# EAGLE design top_spin (EAGLE 5.11)
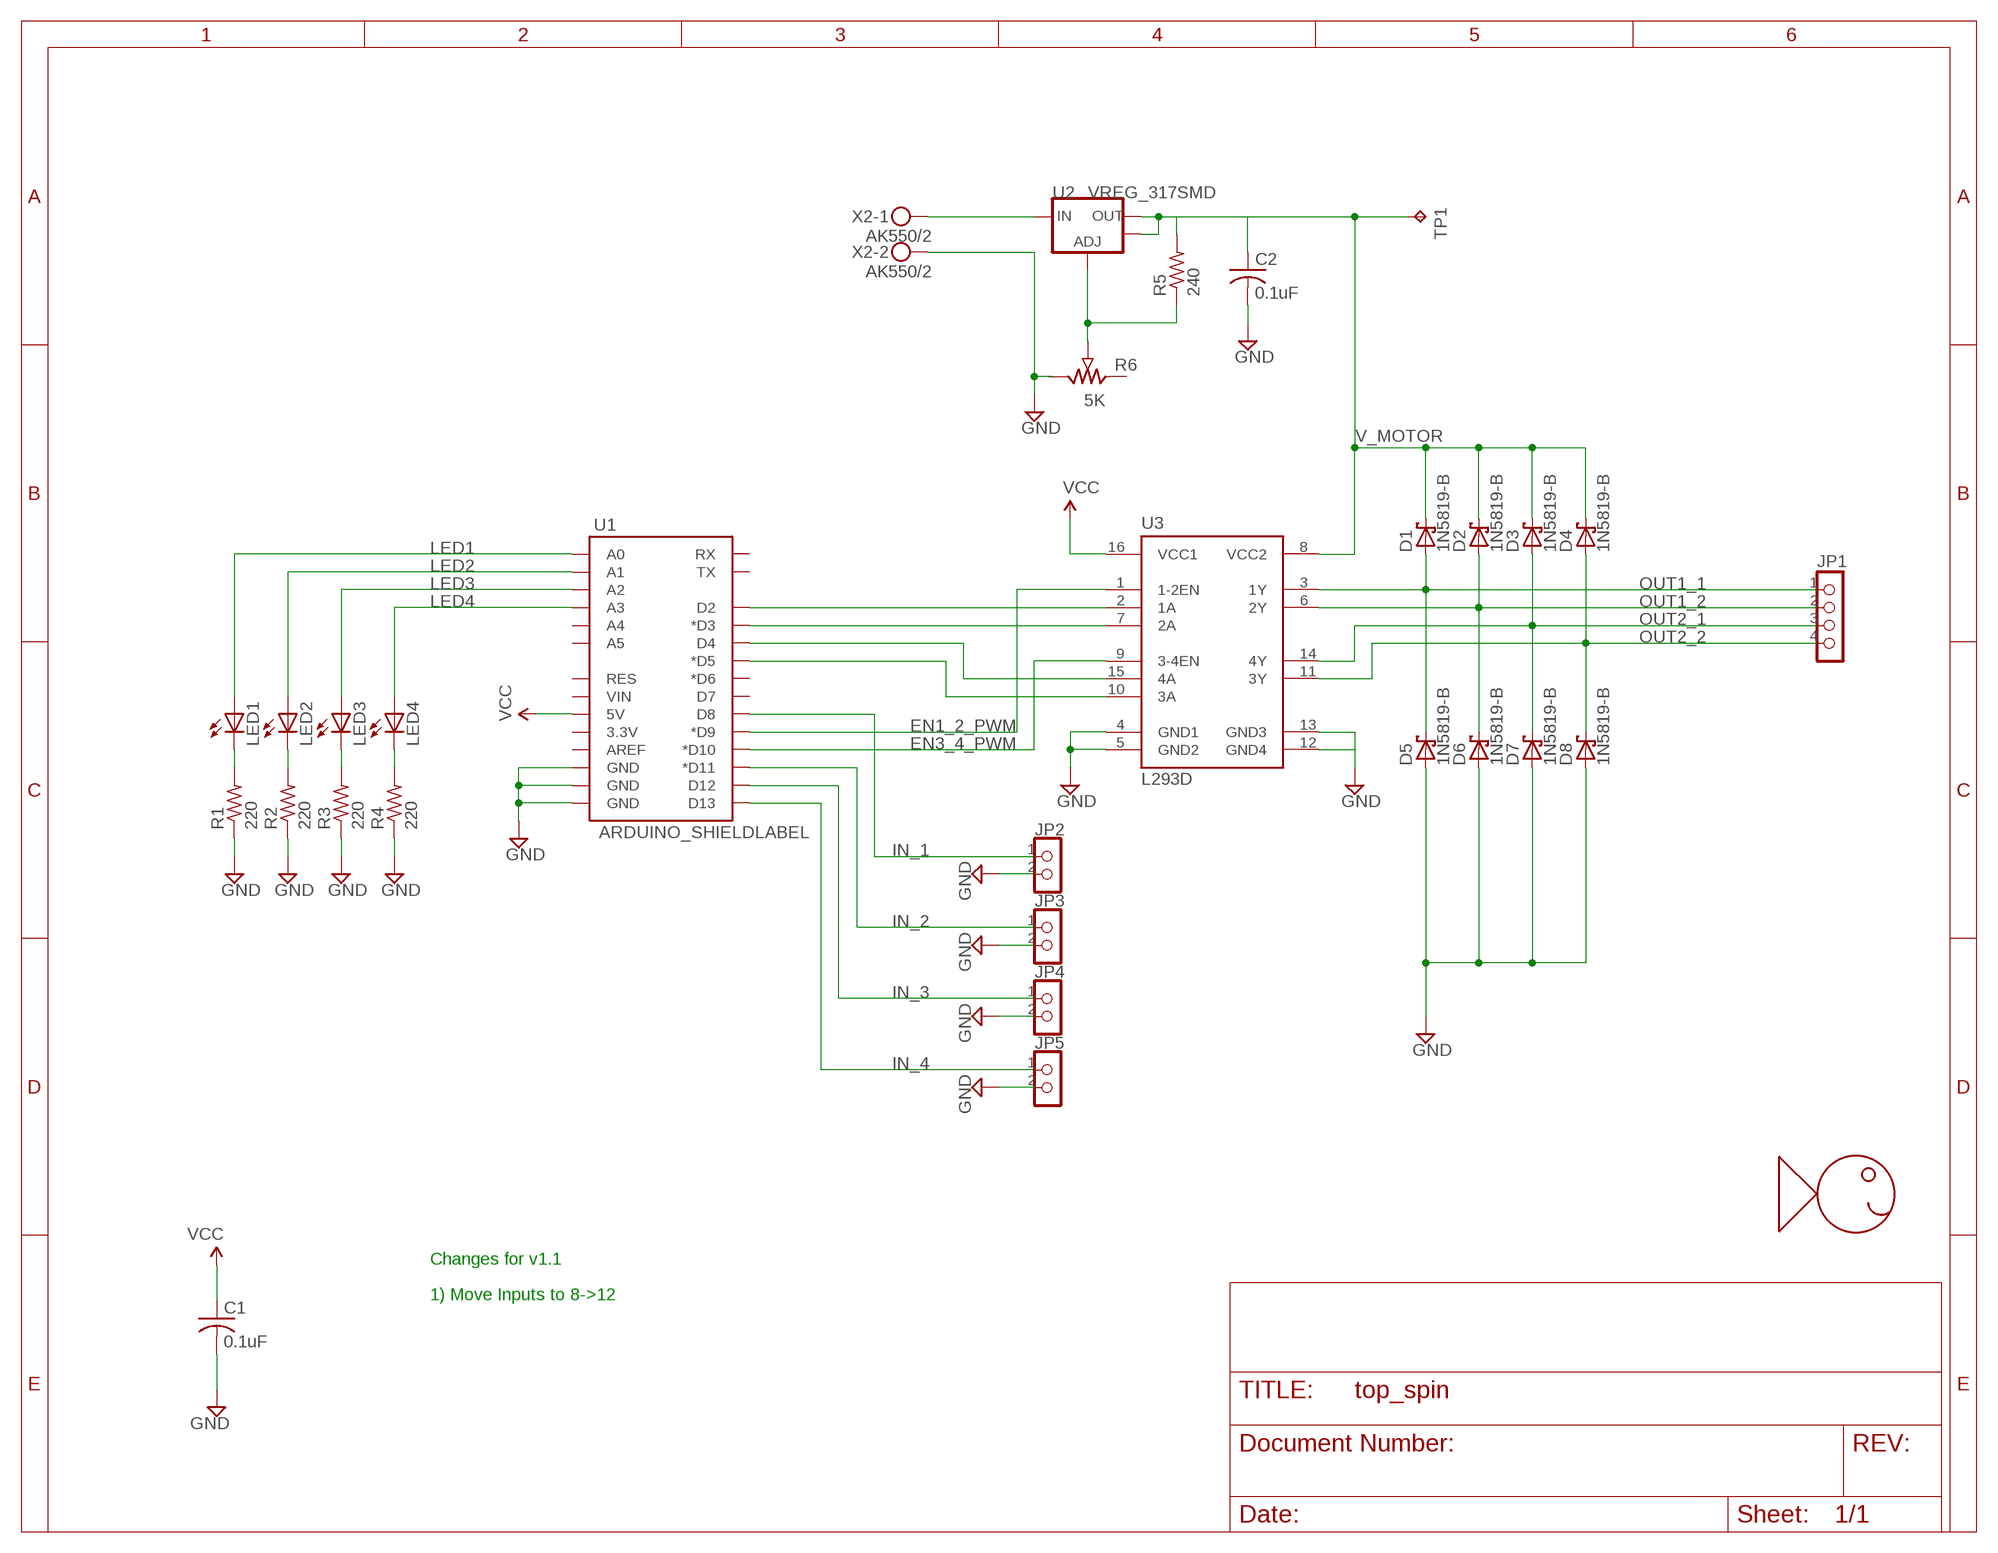
[diagram p0: schematic, sheet 1]

## Parts
C1  0.1uF  CAPACITOR025-030X050  [C025-030X050]
C2  0.1uF  CAPACITOR025-030X050  [C025-030X050]
D1  1N5819-B  [DO41-7.6]
D2  1N5819-B  [DO41-7.6]
D3  1N5819-B  [DO41-7.6]
D4  1N5819-B  [DO41-7.6]
D5  1N5819-B  [DO41-7.6]
D6  1N5819-B  [DO41-7.6]
D7  1N5819-B  [DO41-7.6]
D8  1N5819-B  [DO41-7.6]
JP1  PINHD-1X4/90  [1X04/90]
JP2  PINHD-1X2  [1X02]
JP3  PINHD-1X2  [1X02]
JP4  PINHD-1X2  [1X02]
JP5  PINHD-1X2  [1X02]
LED1  LED3MM  [LED3MM]
LED2  LED3MM  [LED3MM]
LED3  LED3MM  [LED3MM]
LED4  LED3MM  [LED3MM]
R1  220  RESISTOR0207/2V  [0207/2V]
R2  220  RESISTOR0207/2V  [0207/2V]
R3  220  RESISTOR0207/2V  [0207/2V]
R4  220  RESISTOR0207/2V  [0207/2V]
R5  240  RESISTOR0207/2V  [0207/2V]
R6  5K  POTBOURNS_3362H  [BOURNS_3362H]
TP1  TPB1,27  [B1,27]
U1  ARDUINO_SHIELDLABEL  [DUEMILANOVE_SHIELD]
U2  VREG_317SMD  [SOT223]
U3  L293D  [DIL16]
U$1  FHI_LOGO  [FHI_LOGO]
X2  AK550/2  [AK550/2]

## Nets
EN1_2_PWM: U1.D9(*D9) U3.1(1-2EN)
EN3_4_PWM: U1.D10(*D10) U3.9(3-4EN)
GND: C1.2 C2.2 D5.A D6.A D7.A D8.A JP2.2 JP3.2 JP4.2 JP5.2 R1.1 R2.1 R3.1 R4.1 R6.3 U1.GND@0(GND) U1.GND@1(GND) U1.GND@2(GND) U3.4(GND1) U3.5(GND2) U3.12(GND4) U3.13(GND3) X2.2
IN_1: JP2.1 U1.D8
IN_2: JP3.1 U1.D11(*D11)
IN_3: JP4.1 U1.D12
IN_4: JP5.1 U1.D13
LED1: LED1.A U1.A0
LED2: LED2.A U1.A1
LED3: LED3.A U1.A2
LED4: LED4.A U1.A3
N$1: U1.D2 U3.2(1A)
N$2: U1.D3(*D3) U3.7(2A)
N$3: U1.D4 U3.15(4A)
N$4: U1.D5(*D5) U3.10(3A)
N$5: LED1.K(C) R1.2
N$6: LED2.K(C) R2.2
N$7: LED3.K(C) R3.2
N$8: LED4.K(C) R4.2
N$9: U2.3(IN) X2.1
N$11: R5.1 R6.2 U2.1(ADJ)
OUT1_1: D1.A D5.C JP1.1 U3.3(1Y)
OUT1_2: D2.A D6.C JP1.2 U3.6(2Y)
OUT2_1: D3.A D7.C JP1.3 U3.14(4Y)
OUT2_2: D4.A D8.C JP1.4 U3.11(3Y)
V_MOTOR: C2.1 D1.C D2.C D3.C D4.C R5.2 TP1.TP U2.2(OUT1) U2.4(OUT2) U3.8(VCC2)
VCC: C1.1 U1.5V U3.16(VCC1)
Unconnected: R6.1 U1.3.3V U1.A4 U1.A5 U1.AREF U1.D6(*D6) U1.D7 U1.RES U1.RX U1.TX U1.VIN

## Notes on the sheet
- Changes for v1.1
- 1) Move Inputs to 8->12

## Library data of the parts
C1 C2 = CyberRailGuru:CAPACITOR: CAPACITOR, American symbol
D1-D8 = diode:1N581*: 1.0A SCHOTTKY BARRIER RECTIFIER Source: http://www.diodes.com/datasheets/ds23001.pdf
JP1 = CyberRailGuru:PINHD-1X4: PIN HEADER
JP2-JP5 = CyberRailGuru:PINHD-1X2: PIN HEADER
LED1-LED4 = CyberRailGuru:LED: LEDs Standard schematic elements and footprints for 5mm, 3mm, 1206, and 0603 sized LEDs. 5mm - Spark Fun Electronics SKU : COM-00529 (and others)
R1-R5 = CyberRailGuru:RESISTOR: RESISTOR, American symbol
R6 = CyberRailGuru:POT
TP1 = testpad:TP: Test pad
U1 = CyberRailGuru:ARDUINO_SHIELD
U2 = CyberRailGuru:VREG_317: Voltage Regulator Standard LM317 adjustable voltage regulator. AOI (Adjust Output Input). Google 'LM317 Calculator' for easy to use app to get the two resistor values needed. 240/720 for 5V output. 240/390 for 3.3V output. Spark Fun Electronics SKU : COM-00527
U3 = CyberRailGuru:L293D: PUSH-PULL 4 CHANNEL DRIVER; MPN: L293D; OC_FARNELL: 9589619; OC_NEWARK: 56P8249
U$1 = CyberRailGuru:FHI_LOGO: Fishhead Industries Logo
X2 = CyberRailGuru:AK550/2: PCB mount connector; 3.5mm pitch.

## Board
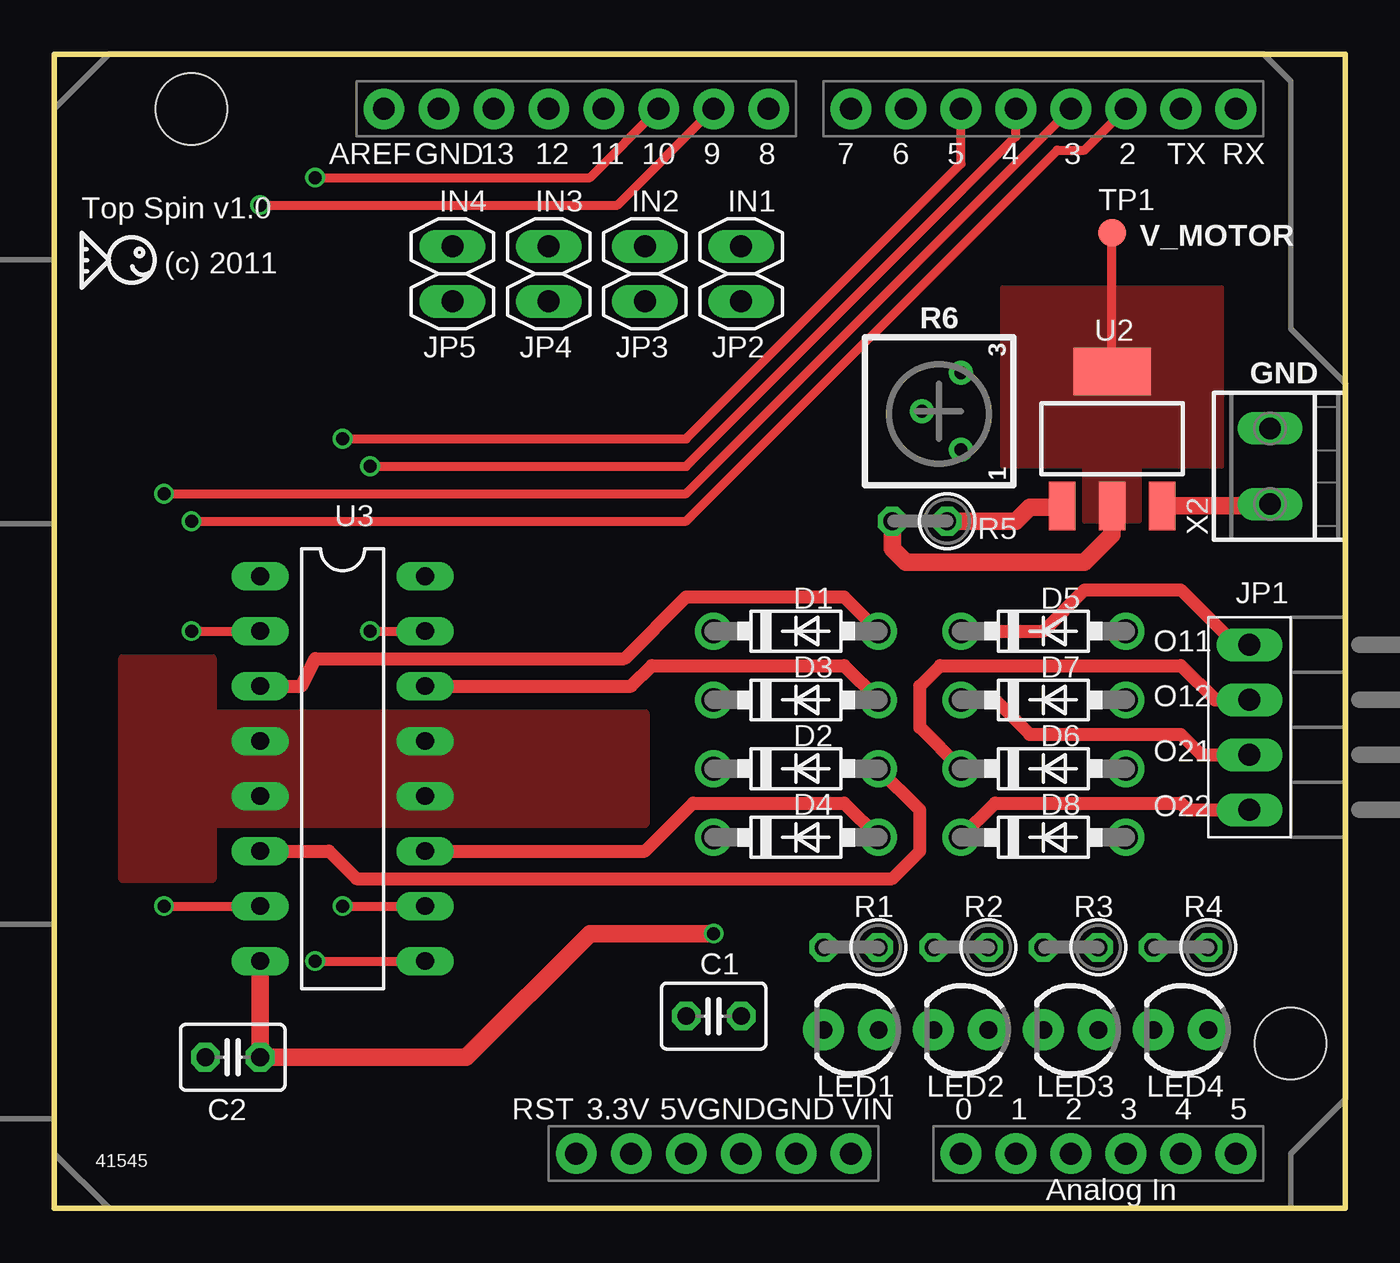
[diagram p1: board, top side]
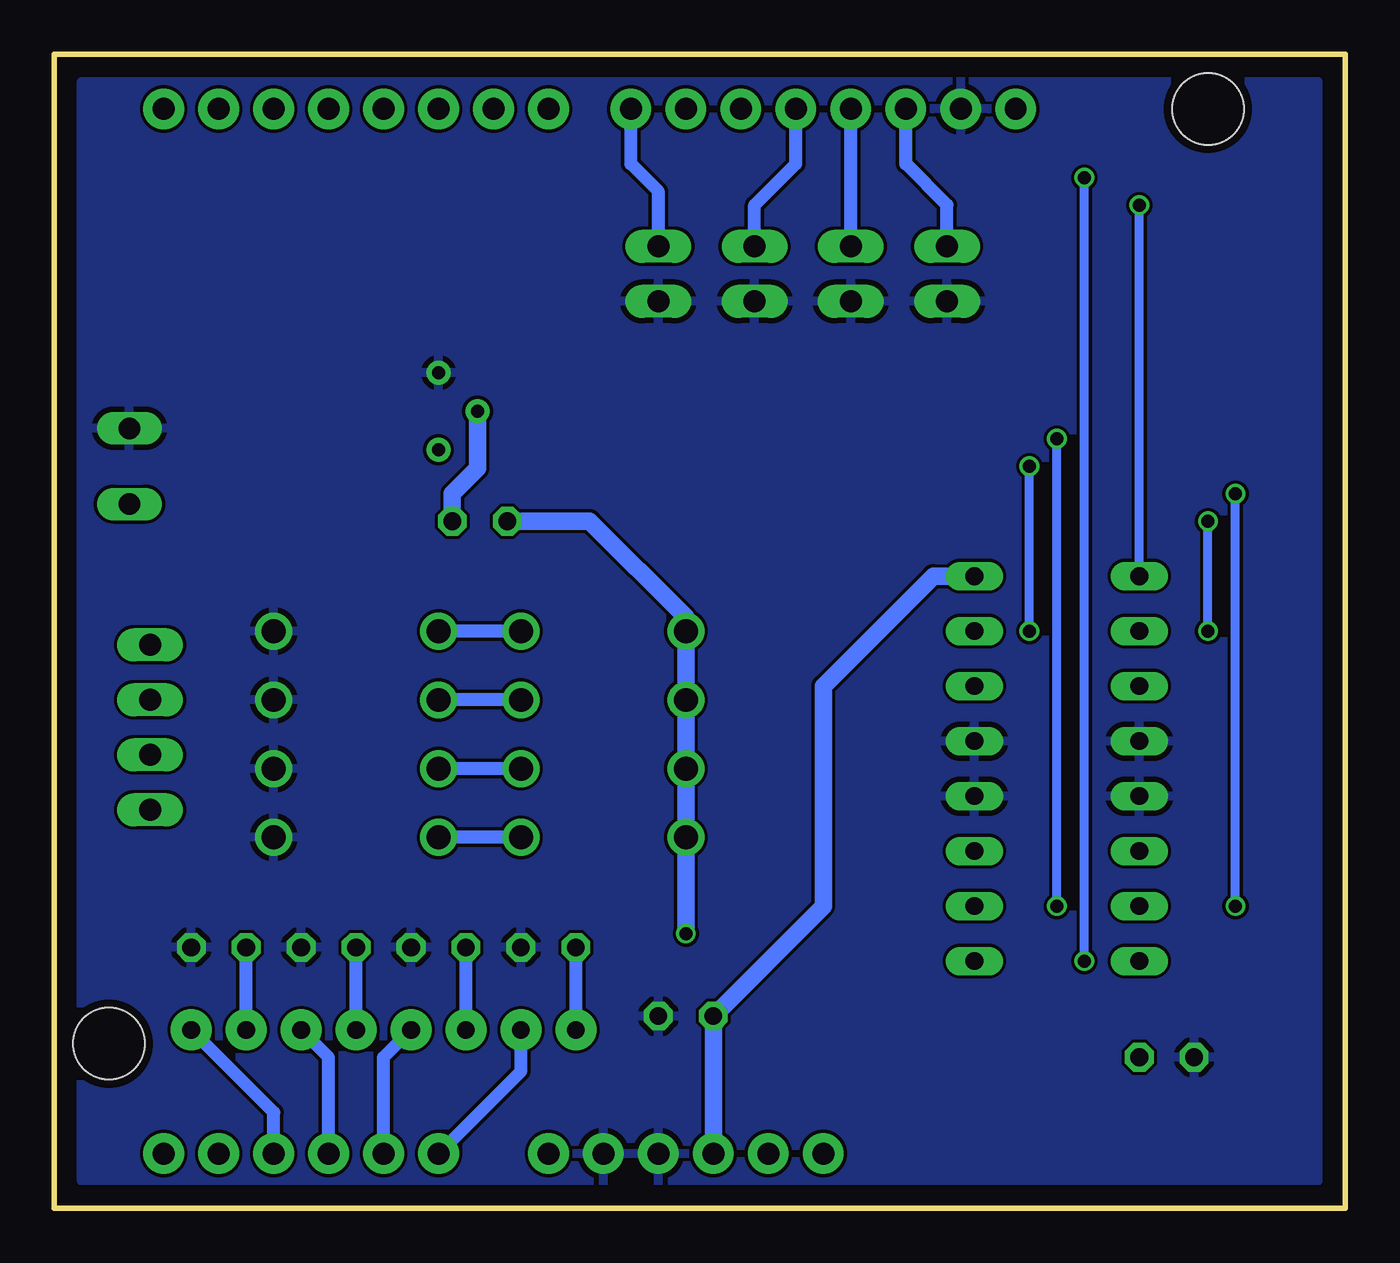
[diagram p2: board, bottom side, seen from below]

Size 59.68 x 53.33 mm. Coordinates in mm from the lower left corner, seen from the top.
Outline: 0,0 59.68,0 59.68,53.33 0,53.33 0,0
Copper layers (1*16): Top 0.035mm / dielectric 1.5mm / Bottom 0.035mm
Design rules "Fusion_eagle_rule_v1.1": minimum track width 6mil, minimum drill 12mil, track to track 6mil, track to pad 6mil, pad to pad 6mil, via to via 6mil, smd to smd 0mil, copper to edge 10mil, drill to drill 10mil, minimum pad ring 10mil, minimum via ring 6mil, stop-mask expansion 2mil, vias tented up to drill 100mil, thermal gap 10mil

### Footprints (pad centres in the part's own frame; a part is rotated, then mirrored left to right if it is on the bottom)
C025-030X050 = drill 0.813 octagon: 1 -1.27,0; 2 1.27,0
DO41-7.6 = drill 1.1 pad 1.7 round: A 3.81,0; C -3.81,0
1X04/90 = drill 1.016 long: 1 -3.81,-3.81; 2 -1.27,-3.81; 3 1.27,-3.81; 4 3.81,-3.81
1X02 = drill 1.016 long: 1 -1.27,0; 2 1.27,0
LED3MM = drill 0.813 pad 1.88 round: A -1.27,0; K 1.27,0
0207/2V = drill 0.813 octagon: 1 -1.27,0; 2 1.27,0
BOURNS_3362H = drill 0.6 round: 1 0,1.778; 2 1.803,0; 3 0,-1.778
B1,27 = smd 1.27 x 1.27: TP 0,0
DUEMILANOVE_SHIELD = drill 1.016 pad 1.88 round: 3.3V 50.8,26.67; 5V 50.8,29.21; A0 50.8,41.91; A1 50.8,44.45; A2 50.8,46.99; A3 50.8,49.53; A4 50.8,52.07; A5 50.8,54.61; AREF 2.54,15.24; D2 2.54,49.53; D3 2.54,46.99; D4 2.54,44.45; D5 2.54,41.91; D6 2.54,39.37; D7 2.54,36.83; D8 2.54,33.02; D9 2.54,30.48; D10 2.54,27.94; D11 2.54,25.4; D12 2.54,22.86; D13 2.54,20.32; GND@0 50.8,31.75; GND@1 50.8,34.29; GND@2 2.54,17.78; RES 50.8,24.13; RX 2.54,54.61; TX 2.54,52.07; VIN 50.8,36.83 | hole 3.302: 45.72,57.15; 2.54,6.35
SOT223 = smd 1.219 x 2.235: 1 -2.311,-3.099; 2 0,-3.099; 3 2.311,-3.099 | smd 3.6 x 2.2: 4 0,3.099
DIL16 = drill 0.813 long: 1 -8.89,-3.81; 2 -6.35,-3.81; 3 -3.81,-3.81; 4 -1.27,-3.81; 5 1.27,-3.81; 6 3.81,-3.81; 7 6.35,-3.81; 8 8.89,-3.81; 9 8.89,3.81; 10 6.35,3.81; 11 3.81,3.81; 12 1.27,3.81; 13 -1.27,3.81; 14 -3.81,3.81; 15 -6.35,3.81; 16 -8.89,3.81
AK550/2 = drill 1 pad 1.5 long: 1 -1.75,0; 2 1.75,0

### Placement (x,y rotation side)
C1  30.48,8.89 0 top
C2  8.26,6.99 180 top
D1  34.29,26.67 0 top
D2  34.29,20.32 0 top
D3  34.29,23.5 0 top
D4  34.29,17.14 0 top
D5  45.72,26.67 0 top
D6  45.72,20.32 0 top
D7  45.72,23.5 0 top
D8  45.72,17.14 0 top
JP1  59.05,22.23 270 top
JP2  31.75,43.18 270 top
JP3  27.3,43.18 270 top
JP4  22.86,43.18 270 top
JP5  18.41,43.18 270 top
LED1  36.83,8.26 180 top
LED2  41.91,8.26 180 top
LED3  46.99,8.26 180 top
LED4  52.07,8.26 180 top
R1  36.83,12.06 180 top
R2  41.91,12.06 180 top
R3  46.99,12.06 180 top
R4  52.07,12.06 180 top
R5  40.01,31.75 180 top
R6  41.91,36.83 180 top
TP1  48.9,45.09 0 top
U1  0,53.34 270 top
U2  48.9,35.56 0 top
U3  13.34,20.32 270 top
U$1  2.54,43.81 0 top
X2  56.2,34.29 90 top

### Tracks (layer width: path | path; a pad name or v marks a point on that pad's centre or on a via)
EN1_2_PWM  (via drill 0.6)
  Top 0.406: v9.53,46.35 26.04,46.35 U1.D9
  Bottom 0.406: U3.1 v9.53,46.35
EN3_4_PWM  (via drill 0.6)
  Top 0.406: v12.06,11.43 U3.9 | v12.06,47.62 24.77,47.62 U1.D10
  Bottom 0.406: v12.06,11.43 v12.06,47.62
GND
  pour Bottom: 1.27,52.07 1.27,1.27 58.42,1.27 58.42,52.07
  pour Top (no thermals): 7.3,22.86 27.3,22.86 27.3,17.78 7.3,17.78 7.3,15.24 3.17,15.24 3.17,25.4 7.3,25.4
IN_1
  Bottom 0.61: JP2.1 31.75,46.99 33.02,48.26 U1.D8
IN_2
  Bottom 0.61: JP3.1 27.3,46.35 25.4,48.26 U1.D11
IN_3
  Bottom 0.61: JP4.1 U1.D12
IN_4
  Bottom 0.61: JP5.1 18.41,46.35 20.32,48.26 U1.D13
LED1
  Bottom 0.61: U1.A0 38.1,6.35 LED1.A
LED2
  Bottom 0.61: LED2.A 44.45,6.99 U1.A1
LED3
  Bottom 0.61: LED3.A 46.99,6.99 U1.A2
LED4
  Bottom 0.61: U1.A3 49.53,4.45 LED4.A
N$1  (via drill 0.6)
  Top 0.406: v6.35,26.67 U3.2 | v6.35,31.75 29.21,31.75 46.35,48.9 47.62,48.9 U1.D2
  Bottom 0.406: v6.35,26.67 v6.35,31.75
N$2  (via drill 0.6)
  Top 0.406: v5.08,13.97 U3.7 | v5.08,33.02 29.21,33.02 U1.D3
  Bottom 0.406: v5.08,13.97 v5.08,33.02
N$3  (via drill 0.6)
  Top 0.406: v14.61,26.67 U3.15 | v14.61,34.29 29.21,34.29 44.45,49.53 U1.D4
  Bottom 0.406: v14.61,26.67 v14.61,34.29
N$4  (via drill 0.6)
  Top 0.406: v13.34,13.97 U3.10 | v13.34,35.56 29.21,35.56 41.91,48.26 U1.D5
  Bottom 0.406: v13.34,13.97 v13.34,35.56
N$5
  Bottom 0.61: LED1.K R1.2
N$6
  Bottom 0.61: LED2.K R2.2
N$7
  Bottom 0.61: LED3.K R3.2
N$8
  Bottom 0.61: LED4.K R4.2
N$9
  Top 0.813: U2.3 56.12,32.46 X2.1
N$11
  Top 0.813: U2.1 46.51,32.38 45.09,32.38 44.45,31.75 R5.1
  Bottom 0.813: R6.2 40.11,34.19 41.27,33.02 R5.1
OUT1_1
  Top 0.61: U3.3 11.43,24.13 12.06,25.4 26.35,25.4 29.21,28.26 36.51,28.26 D1.A | D5.C 45.72,26.67 47.62,28.57 52.07,28.57 54.61,26.04 JP1.1
  Bottom 0.61: D1.A D5.C
OUT1_2
  Top 0.61: U3.6 12.7,16.51 13.97,15.24 38.73,15.24 40.01,16.51 40.01,18.41 D2.A | D6.C 40.01,22.23 40.01,24.13 40.96,25.08 52.07,25.08 53.66,23.5 JP1.2
  Bottom 0.61: D2.A D6.C
OUT2_1
  Top 0.61: U3.14 26.67,24.13 27.62,25.08 36.51,25.08 D3.A | D7.C 43.5,23.5 45.09,21.91 52.07,21.91 53.02,20.95 JP1.3
  Bottom 0.61: D3.A D7.C
OUT2_2
  Top 0.61: U3.11 27.3,16.51 29.53,18.73 36.51,18.73 D4.A | D8.C 43.5,18.73 52.07,18.73 52.39,18.41 JP1.4
  Bottom 0.61: D4.A D8.C
V_MOTOR  (via drill 0.6)
  Top 0.406: U2.4 TP1.TP
  Top 0.813: U2.2 48.9,31.11 47.62,29.84 39.37,29.84 38.73,30.48 R5.2 | v30.48,12.7 24.77,12.7 19.05,6.99 C2.1 U3.8
  Bottom 0.813: v30.48,12.7 D4.C D2.C D3.C D1.C 30.48,27.3 34.92,31.75 R5.2
  pour Top (no thermals): 47.62,31.75 47.62,34.29 43.81,34.29 43.81,42.55 53.98,42.55 53.98,34.29 50.16,34.29 50.16,31.75
VCC
  Bottom 0.813: U3.16 19.05,29.21 24.13,24.13 24.13,13.97 C1.1 U1.5V

### Text on the board
tPlace: Top Spin v1.0 | (c) 2011 | 41545
tNames: IN4 | IN3 | IN2 | IN1 | V_MOTOR | GND | O11 | O12 | O21 | O22